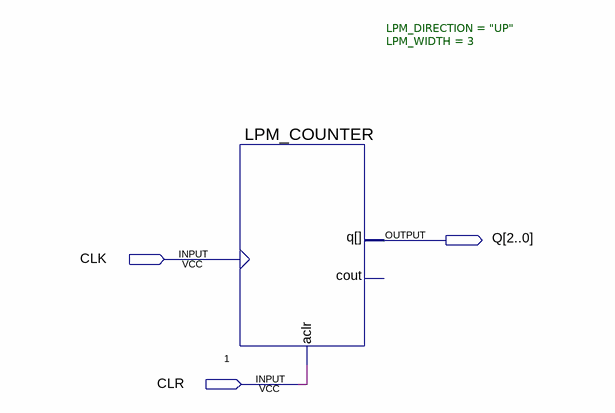
[diagram p0: schematic sheet]
// Quartus schematic cnt3.bdf as structural Verilog: 1 symbols, 3 pins
module cnt3 (
  input  CLK,
  input  CLR,
  output [2:0] Q
);

  LPM_COUNTER #(.LPM_DIRECTION("UP"), .LPM_WIDTH(3)) u_1 (.clock(CLK), .aclr(CLR), .q(Q));  // open: cout
endmodule
